# EAGLE design base (EAGLE 7.3.0)
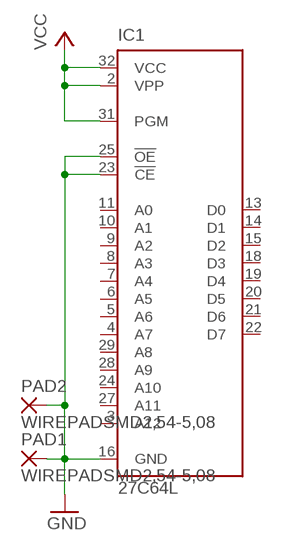
[diagram p0: schematic, sheet 1]

## Parts
IC1  27C64L  [PLCC-32]
PAD1  WIREPADSMD2,54-5,08  [SMD2,54-5,08]
PAD2  WIREPADSMD2,54-5,08  [SMD2,54-5,08]

## Nets
GND: IC1.16(GND) IC1.23(!CE) IC1.25(!OE) PAD1.1(P) PAD2.1(P)
VCC: IC1.2(VPP) IC1.31(PGM) IC1.32(VCC)
Unconnected: IC1.1(NC) IC1.3(A12) IC1.4(A7) IC1.5(A6) IC1.6(A5) IC1.7(A4) IC1.8(A3) IC1.9(A2) IC1.10(A1) IC1.11(A0) IC1.13(D0) IC1.14(D1) IC1.15(D2) IC1.18(D3) IC1.19(D4) IC1.20(D5) IC1.21(D6) IC1.22(D7) IC1.24(A10) IC1.27(A11) IC1.28(A9) IC1.29(A8)

## Library data of the parts
IC1 = microchip:27*64: CMOS EPROM 64 K (8 K x 8), low voltage; OC_FARNELL: unknown; OC_NEWARK: unknown
PAD1 PAD2 = wirepad:WIREPAD: Wire PAD connect wire on PCB

## Board
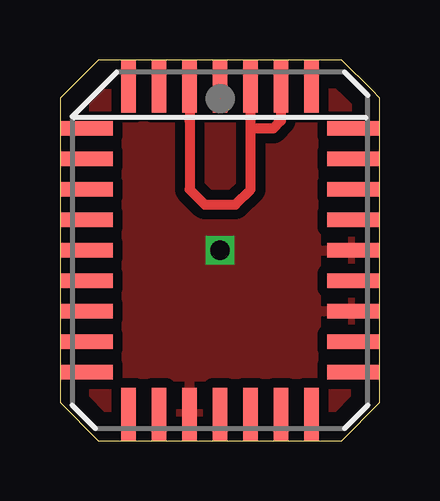
[diagram p1: board, top side]
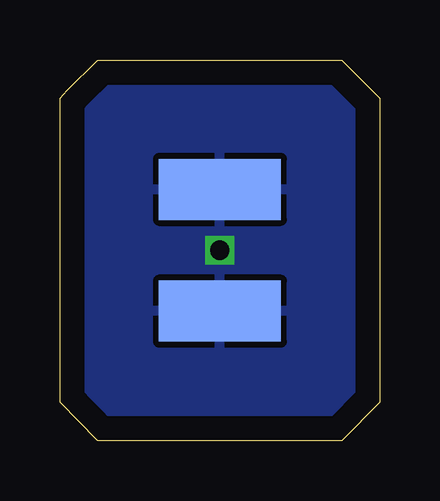
[diagram p2: board, bottom side, seen from below]

Size 13.32 x 15.88 mm. Coordinates in mm from the lower left corner, seen from the top.
Outline: 1.59,0 11.75,0 13.32,1.6 13.32,14.28 13.02,14.61 11.75,15.88 1.59,15.88 0.01,14.28 0,14.28 0,1.59 1.59,0
Copper layers (1*16): Top 0.035mm / dielectric 1.5mm / Bottom 0.035mm
Design rules "default": minimum track width 10mil, minimum drill 24mil, track to track 8mil, track to pad 8mil, pad to pad 8mil, via to via 8mil, smd to smd 8mil, copper to edge 40mil, drill to drill 8mil, minimum pad ring 10mil, minimum via ring 8mil, stop-mask expansion 4mil, vias tented up to drill 0mil, thermal gap 10mil

### Footprints (pad centres in the part's own frame; a part is rotated, then mirrored left to right if it is on the bottom)
PLCC-32 = smd 2.2 x 0.6: 1 -6.83,0; 2 -6.83,-1.27; 3 -6.83,-2.54; 4 -6.83,-3.81; 14 6.83,-3.81; 15 6.83,-2.54; 16 6.83,-1.27; 17 6.83,0; 18 6.83,1.27; 19 6.83,2.54; 20 6.83,3.81; 30 -6.83,3.81; 31 -6.83,2.54; 32 -6.83,1.27 | smd 0.6 x 2.2: 5 -5.08,-5.56; 6 -3.81,-5.56; 7 -2.54,-5.56; 8 -1.27,-5.56; 9 0,-5.56; 10 1.27,-5.56; 11 2.54,-5.56; 12 3.81,-5.56; 13 5.08,-5.56; 21 5.08,5.56; 22 3.81,5.56; 23 2.54,5.56; 24 1.27,5.56; 25 0,5.56; 26 -1.27,5.56; 27 -2.54,5.56; 28 -3.81,5.56; 29 -5.08,5.56
SMD2,54-5,08 = smd 2.54 x 5.08: 1 0,0

### Placement (x,y rotation side)
IC1  6.67,7.94 270 top
PAD1  6.67,5.4 90 bottom
PAD2  6.67,10.48 270 bottom

### Tracks (layer width: path | path; a pad name or v marks a point on that pad's centre or on a via)
GND  (via drill 0.8)
  other vias: 6.67,7.94
  pour Top (isolate 0.406): 0,15.88 13.34,15.88 13.34,0 0,0
  pour Bottom (isolate 0.406): 0,15.88 13.34,15.88 13.34,0 0,0
VCC
  Top 0.406: 5.4,13.34 IC1.2 5.4,10.48 6.03,9.84 7.3,9.84 7.94,10.48 7.94,13.02 | 7.94,13.02 IC1.32 | IC1.31 9.21,13.34 8.89,13.02 7.94,13.02